# Altium schematic sheet WSN_v2.SchDoc
size A3; SheetNumber: 1; SheetTotal: 2
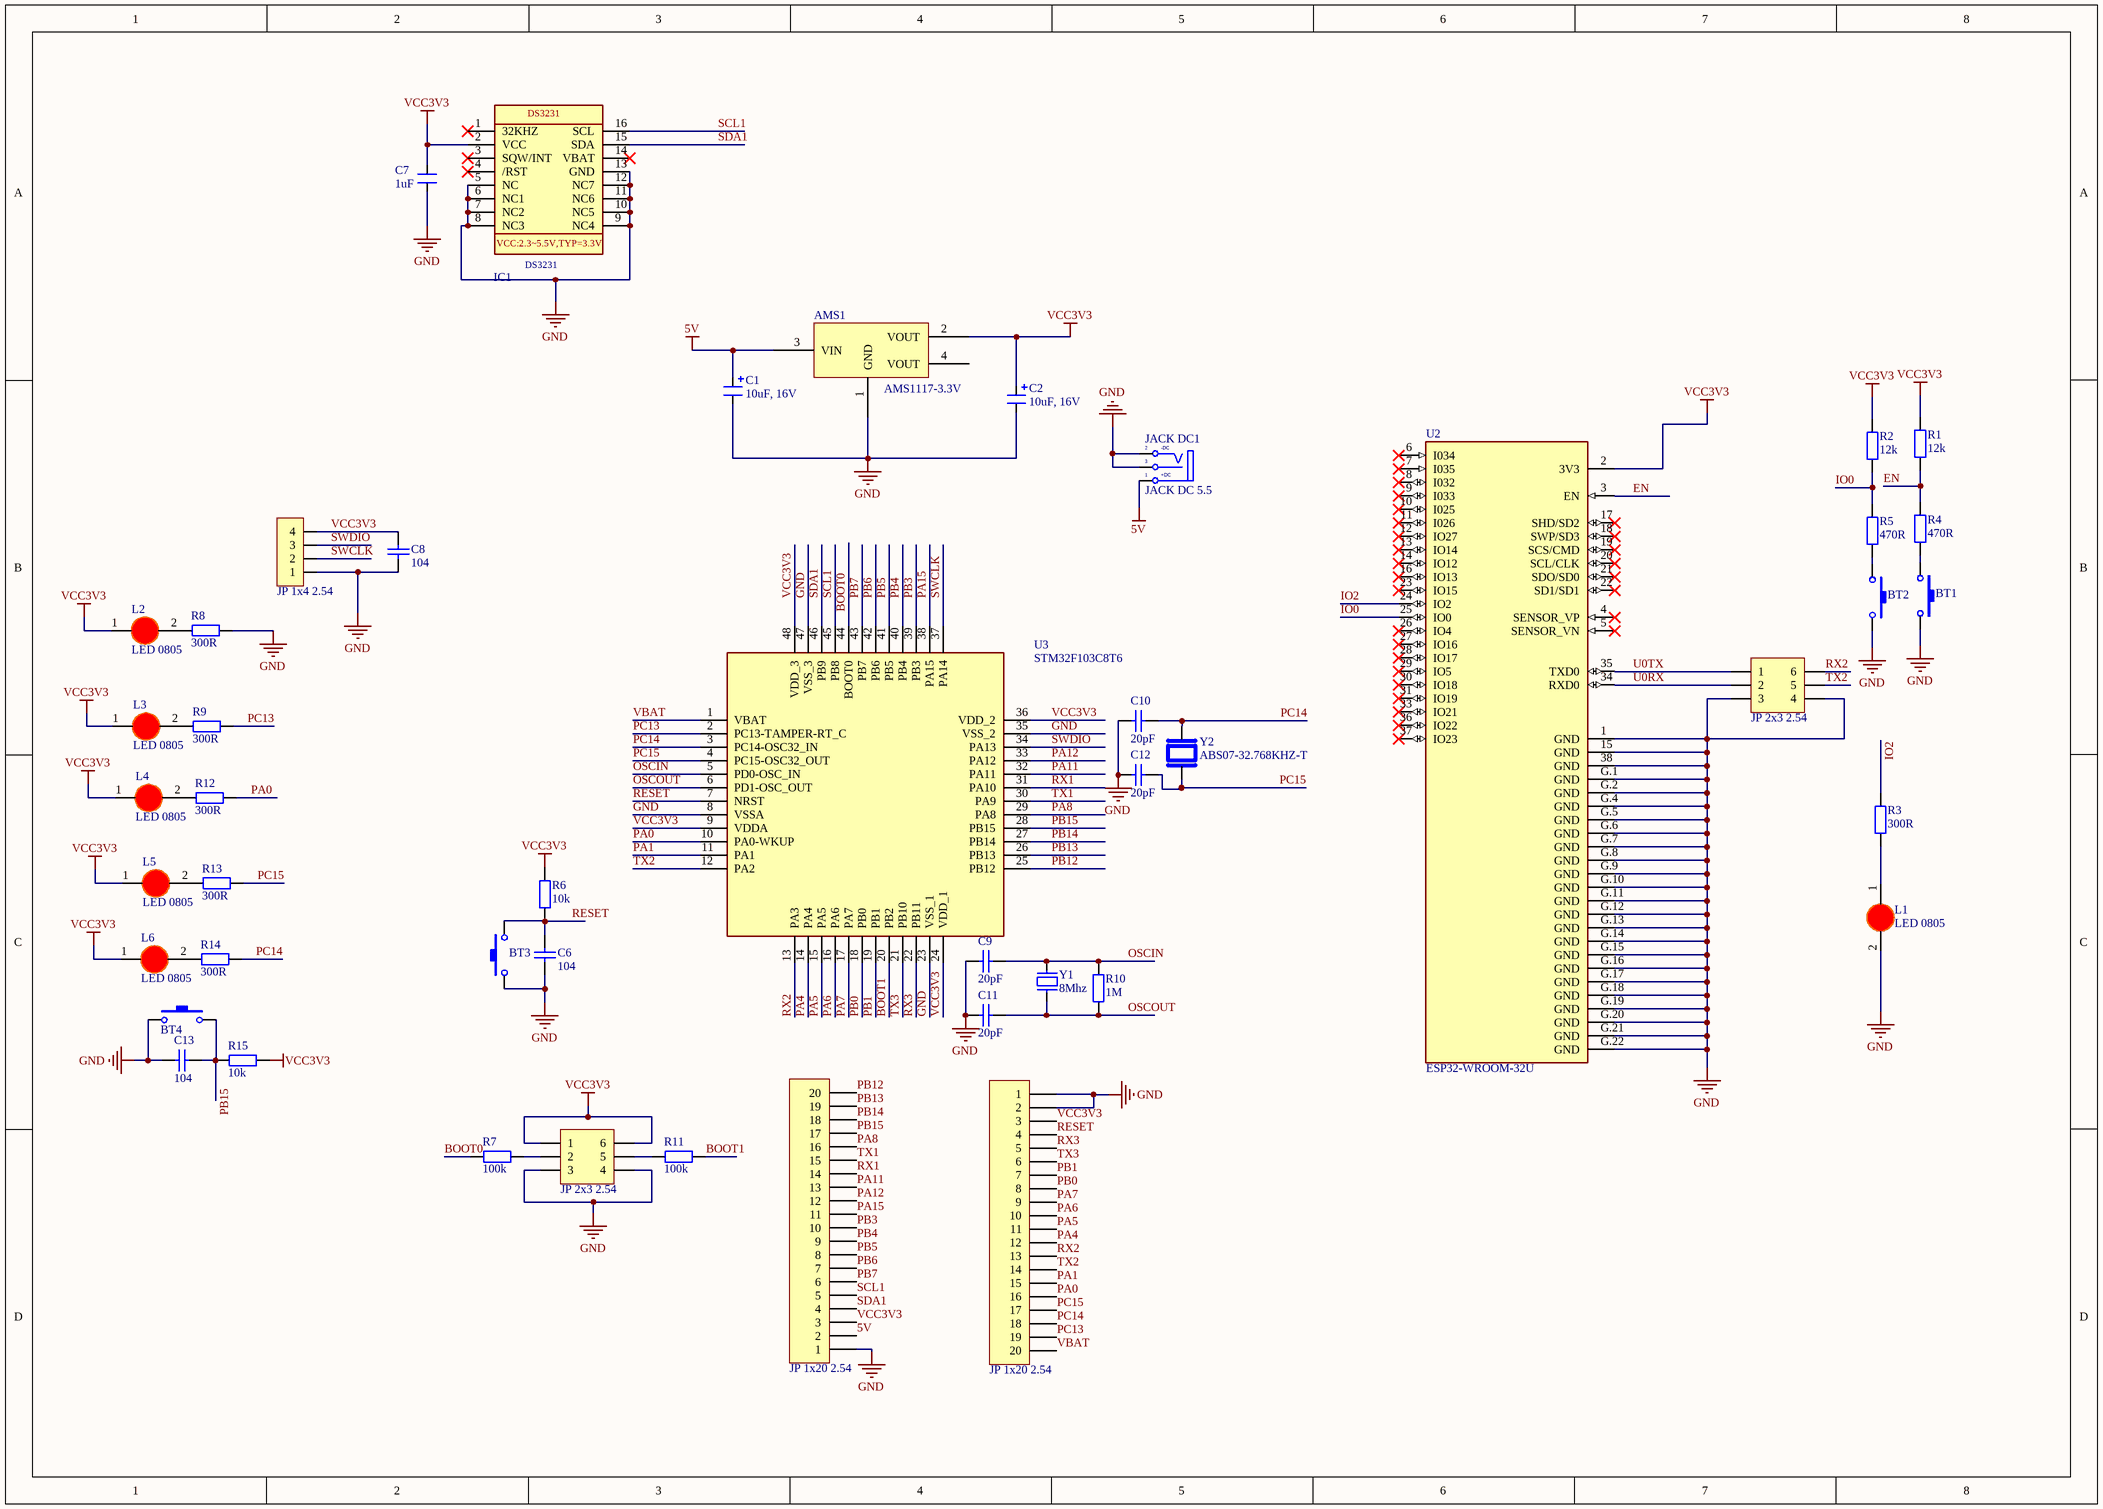
[diagram p0: WSN_v2.SchDoc]

## Parts
AMS1  AMS1117-3.3V  [SOT223-4N]
BT1  Nut Nhan 2 Chan SMD 3x6x2.5  [Nut Nhan 2 Chan SMD 3x6x2.5]  (value not drawn)
BT2  Nut Nhan 2 Chan SMD 3x6x2.5  [Nut Nhan 2 Chan SMD 3x6x2.5]  (value not drawn)
BT3  Nut Nhan 2 Chan SMD 3x6x2.5  [Nut Nhan 2 Chan SMD 3x6x2.5]  (value not drawn)
BT4  Nut Nhan 2 Chan SMD 3x6x2.5  [Nut Nhan 2 Chan SMD 3x6x2.5]  (value not drawn)
C1  10uF, 16V  [C_FC_10UF_16V]
C2  10uF, 16V  [C_FC_10UF_16V]
C6  104  [tu 0805]
C7  1uF  [Cap Ceramic 0805 SMD]
C8  104  [tu 0805]
C9  20pF  [tu 0805]
C10  20pF  [tu 0805]
C11  20pF  [tu 0805]
C12  20pF  [tu 0805]
C13  104  [tu 0805]
IC1  DS3231  [SOIC-16]  (value not drawn)
JACK_DC1  JACK DC 5.5  [JACK DC 5.5]
JP1  JP 1x4 2.54  [JP 1x4 DT]
JP2  JP 2x3 2.54  [JP 2x3 DT]
JP3  JP 1x20 2.54  [JP 1x20 DT]
JP4  JP 1x20 2.54  [JP 1x20 DT]
JP5  JP 2x3 2.54  [JP 2x3 DT]
L1  LED 0805  [LED-1206-Red]
L2  LED 0805  [LED-1206-Red]
L3  LED 0805  [LED-1206-Red]
L4  LED 0805  [LED-1206-Red]
L5  LED 0805  [LED-1206-Red]
L6  LED 0805  [LED-1206-Red]
R1  12k  [tro smd 0805]
R2  12k  [tro smd 0805]
R3  300R  [Tro SMD 0805]
R4  470R  [Tro SMD 0805]
R5  470R  [Tro SMD 0805]
R6  10k  [tro smd 0805]
R7  100k  [tro smd 0805]
R8  300R  [Tro SMD 0805]
R9  300R  [Tro SMD 0805]
R10  1M  [tro smd 0805]
R11  100k  [tro smd 0805]
R12  300R  [Tro SMD 0805]
R13  300R  [Tro SMD 0805]
R14  300R  [Tro SMD 0805]
R15  10k  [tro smd 0805]
U2  ESP32-WROOM-32U  [XCVR_ESP32-WROOM-32U]
U3  STM32F103C8T6  [LQFP-48_19.6_393_58X11_SMD]
Y1  8Mhz  [Thach Anh 2 chan SMD]
Y2  ABS07-32.768KHZ-T  [XTAL_ABS07-32.768KHZ-T]

## Nets
5V: AMS1.3(VIN) C1.1 JACK_DC1.1(T) JP3.2
GND: AMS1.1(GND) BT1.2 BT2.2 BT3.1 BT4.1 C1.2 C2.2 C6.2 C7.1 C8.2 C9.2 C10.2 C11.2 C12.2 C13.2 IC1.5(NC) IC1.6(NC1) IC1.7(NC2) IC1.8(NC3) IC1.9(NC4) IC1.10(NC5) IC1.11(NC6) IC1.12(NC7) IC1.13(GND) JACK_DC1.2(TN) JACK_DC1.3(S) JP1.1 JP2.3 JP2.4 JP3.1 JP4.1 JP4.2 JP5.3 JP5.4 L1.2(K) R8.2 U2.1(GND) U2.15(GND) U2.38(GND) U2.G.1(GND) U2.G.2(GND) U2.G.4(GND) U2.G.5(GND) U2.G.6(GND) U2.G.7(GND) U2.G.8(GND) U2.G.9(GND) U2.G.10(GND) U2.G.11(GND) U2.G.12(GND) U2.G.13(GND) U2.G.14(GND) U2.G.15(GND) U2.G.16(GND) U2.G.17(GND) U2.G.18(GND) U2.G.19(GND) U2.G.20(GND) U2.G.21(GND) U2.G.22(GND) U3.8(VSSA) U3.23(VSS_1) U3.35(VSS_2) U3.47(VSS_3)
VCC3V3: AMS1.2(VOUT) C2.1 C7.2 C8.1 IC1.2(VCC) JP1.4 JP2.1 JP2.6 JP3.3 JP4.3 L2.1(A) L3.1(A) L4.1(A) L5.1(A) L6.1(A) R1.2 R2.2 R6.2 R15.2 U2.2(3V3) U3.9(VDDA) U3.24(VDD_1) U3.36(VDD_2) U3.48(VDD_3)
BOOT0: R7.1 U3.44(BOOT0)
BOOT1: R11.2 U3.20(PB2)
EN: R1.1 R4.2 U2.3(EN)
IO0: R2.1 R5.2 U2.25(IO0)
IO2: R3.1 U2.24(IO2)
OSCIN: C9.1 R10.2 U3.5(PD0-OSC_IN) Y1.2
OSCOUT: C11.1 R10.1 U3.6(PD1-OSC_OUT) Y1.1
PA0: JP4.16 R12.2 U3.10(PA0-WKUP)
PA1: JP4.15 U3.11(PA1)
PA4: JP4.12 U3.14(PA4)
PA5: JP4.11 U3.15(PA5)
PA6: JP4.10 U3.16(PA6)
PA7: JP4.9 U3.17(PA7)
PA8: JP3.16 U3.29(PA8)
PA11: JP3.13 U3.32(PA11)
PA12: JP3.12 U3.33(PA12)
PA15: JP3.11 U3.38(PA15)
PB0: JP4.8 U3.18(PB0)
PB1: JP4.7 U3.19(PB1)
PB3: JP3.10 U3.39(PB3)
PB4: JP3.9 U3.40(PB4)
PB5: JP3.8 U3.41(PB5)
PB6: JP3.7 U3.42(PB6)
PB7: JP3.6 U3.43(PB7)
PB12: JP3.20 U3.25(PB12)
PB13: JP3.19 U3.26(PB13)
PB14: JP3.18 U3.27(PB14)
PB15: BT4.2 C13.1 JP3.17 R15.1 U3.28(PB15)
PC13: JP4.19 R9.2 U3.2(PC13-TAMPER-RT_C)
PC14: C10.1 JP4.18 R14.2 U3.3(PC14-OSC32_IN) Y2.2
PC15: C12.1 JP4.17 R13.2 U3.4(PC15-OSC32_OUT) Y2.1
RESET: BT3.2 C6.1 JP4.4 R6.1 U3.7(NRST)
RX1: JP3.14 U3.31(PA10)
RX2: JP4.13 JP5.6 U3.13(PA3)
RX3: JP4.5 U3.22(PB11)
SCL1: IC1.16(SCL) JP3.5 U3.45(PB8)
SDA1: IC1.15(SDA) JP3.4 U3.46(PB9)
SWCLK: JP1.2 U3.37(PA14)
SWDIO: JP1.3 U3.34(PA13)
TX1: JP3.15 U3.30(PA9)
TX2: JP4.14 JP5.5 U3.12(PA2)
TX3: JP4.6 U3.21(PB10)
U0RX: JP5.2 U2.34(RXD0)
U0TX: JP5.1 U2.35(TXD0)
VBAT: JP4.20 U3.1(VBAT)
NetBT1_1: BT1.1 R4.1
NetBT2_1: BT2.1 R5.1
NetJP2_2: JP2.2 R7.2
NetJP2_5: JP2.5 R11.1
NetL1_1: L1.1(A) R3.2
NetL2_2: L2.2(K) R8.1
NetL3_2: L3.2(K) R9.1
NetL4_2: L4.2(K) R12.1
NetL5_2: L5.2(K) R13.1
NetL6_2: L6.2(K) R14.1

Not connected (* = marked no-connect by the designer): AMS1 4(VOUT); IC1 1(32KHZ)* 3(SQW/INT)* 4(/RST)* 14(VBAT)*; U2 4(SENSOR_VP)* 5(SENSOR_VN)* 6(I034)* 7(I035)* 8(I032)* 9(I033)* 10(I025)* 11(I026)* 12(IO27)* 13(IO14)* 14(IO12)* 16(IO13)* 17(SHD/SD2)* 18(SWP/SD3)* 19(SCS/CMD)* 20(SCL/CLK)* 21(SDO/SD0)* 22(SD1/SD1)* 23(IO15)* 26(IO4)* 27(IO16)* 28(IO17)* 29(IO5)* 30(IO18)* 31(IO19)* 33(IO21)* 36(IO22)* 37(IO23)*

## Notes on the sheet
- (in symbol DS3231) VCC:2.3~5.5V,TYP=3.3V
- (in symbol JACK DC 5.5) -DC; +DC

## Library data of the parts
AMS1 = AMS1117: Dán; Value: AMS1117-3.3V SOT223; Don_Vi: Con; Ma_Hang: MH000596; Ghi_Chu: *; Kieu_Chan: *; Chung_Loai: Dán
BT1-BT4 = Nut Nhan 2 Chan SMD 3x6x2.5: Ma_Hang: MH001036; Ten: Nút Nhấn 2 Chân 3x6x2.5MM SMD
C1 C2 = CM-TANTALUM: Cap SMD, TANTALUM; Value: 103
C6 C8 C13 = Tu 0805 104 50V 10%: Dán; Don_Vi: Con; So_Chan: 2; Ten_Linh_Kien: Tụ 0805 104-100nF 10% 50V; Ma_Hang: MH004551; Chung_Loai: Dán; Kieu_Chan: *
C7 = CM: Cap SMD; Value: 1uF
C9-C12 = Tu 0805 20pF 50V 10%: Dán; Don_Vi: Con; Ten_Linh_Kien: Tụ 0805 20P 10% 50V; So_Chan: 2; Ma_Hang: MH004558; Chung_Loai: Dán; Kieu_Chan: *
IC1 = DS3231: RTC DS3231; MF: Maxim Integrated; Value: *; MP: DS3231; Package: SOIC-16 Maxim Integrated; Price: None; SnapEDA_Link: https://www.snapeda.com/parts/DS3231/Maxim%20Integrated/view-part/553791/?ref=snap; Availability: Unavailable
JACK_DC1 = JACK DC 5.5: Value: Jac DC
JP1 = JP 1x4 2.54 Duc Thang: Cắm; Ten_Linh_Kien: Jump Đơn Đực 2.54MM 1x40P Thẳng 11MM; Don_Vi: Con; Ma_Hang: MH000903; Ghi_Chu: *; Kieu_Chan: *; Chung_Loai: Cắm
JP2 JP5 = JP 2x3 2.54 Duc Thang: Cắm; Ten_Linh_Kien: Jump Đôi Đực 2.54MM 2x40P Thẳng 11MM; Don_Vi: Con; Ma_Hang: MH002686; Ghi_Chu: *; Kieu_Chan: *; Chung_Loai: Cắm
JP3 JP4 = JP 1x20 2.54 Duc Thang: Cắm; Ten_Linh_Kien: Jump Đơn Đực 2.54MM 1x40P Thẳng 11MM; Don_Vi: Con; Ma_Hang: MH000903; Ghi_Chu: *; Kieu_Chan: *; Chung_Loai: Cắm
L1-L6 = LED 1206 Do: Dán; Don_Vi: Con; Ma_Hang: MH002334; Ten_Linh_Kien: LED1206 Màu Đỏ (Red); Ghi_Chu: *; Kieu_Chan: *; Chung_Loai: Dán
R1 R2 = Tro 0805 1% 12k: Dán; Don_Vi: Con; So_Chan: 2; Ten_Linh_Kien: Trở 0805 1% 12k; Ma_Hang: MH005475; Chung_Loai: Dán; Kieu_Chan: *
R3 R8 R9 R12-R14 = Tro 0805 5% 300R: Dán; Don_Vi: Con; So_Chan: 2; Ten_Linh_Kien: Trở 0805 5% 300R; Ma_Hang: MH005335; Chung_Loai: Dán; Kieu_Chan: *
R4 R5 = Tro 0805 5% 470R: Dán; Don_Vi: Con; Ma_Hang: MH005341; Ten_Linh_Kien: Trở 0805 5% 470R; So_Chan: 2; Chung_Loai: Dán; Kieu_Chan: *
R6 R15 = Tro 0805 5% 10k: Dán; Don_Vi: Con; So_Chan: 2; Ten_Linh_Kien: Trở 0805 5% 10k; Ma_Hang: MH005239; Chung_Loai: Dán; Kieu_Chan: *
R7 R11 = Tro 0805 5% 100k: Dán; Don_Vi: Con; So_Chan: 2; Ten_Linh_Kien: Trở 0805 5% 100k; Ma_Hang: MH005250; Chung_Loai: Dán; Kieu_Chan: *
R10 = Tro 0805 5% 1M: Dán; Don_Vi: Con; So_Chan: 2; Ten_Linh_Kien: Trở 0805 5% 1M; Ma_Hang: MH005235; Chung_Loai: Dán; Kieu_Chan: *
U2 = ESP32-WROOM-32U: Bluetooth, WiFi 802.11b/g/n, Bluetooth v4.2 +EDR, Class 1, 2 and 3 Transceiver Module 2.4GHz ~ 2.5GHz Antenna Not Included, U.FL Surface Mount; MF: Espressif Systems; MP: ESP32-WROOM-32U; Price: None; Package: NON STANDARD-39 Espressif; Check_prices: https://www.snapeda.com/parts/ESP32-WROOM-32U/Espressif+Systems/view-part/?ref=eda; Value: *; Availability: Not in stock; SnapEDA_Link: https://www.snapeda.com/parts/ESP32-WROOM-32U/Espressif+Systems/view-part/?ref=snap
U3 = IC_STM32F103C8T6: ARM® Cortex®-M3 STM32F1 Microcontroller IC 32-Bit 72MHz 64KB (64K x 8) FLASH 48-LQFP (7x7); Manufacturer: STMicroelectronics; Alternate Part Number-1: NA; Manufacturer Part Number: STM32F103C8T6; Case/Package: LQFP48; Supplier-1: LCSC; Supplier Part Number-1: STM32F103C8T6
Y1 = Thach Anh 2 chan SMD: Crystal For all Crystal 2pin.; Value: 4Mhz
Y2 = ABS07-32.768KHZ-T: 32.768 kHz Â±20ppm Crystal 12.5pF 70 kOhms 2-SMD, No Lead; MF: Abracon; SnapEDA_Link: https://www.snapeda.com/parts/ABS07-32.768KHZ-T/Abracon+LLC/view-part/?ref=snap; Package: SMD-2 Abracon LLC; Value: *; MP: ABS07-32.768KHZ-T; Check_prices: https://www.snapeda.com/parts/ABS07-32.768KHZ-T/Abracon+LLC/view-part/?ref=eda